# Altium schematic sheet 10_USB.SchDoc
size 420 x 297 mm; SheetNumber: 19; SheetTotal: 33
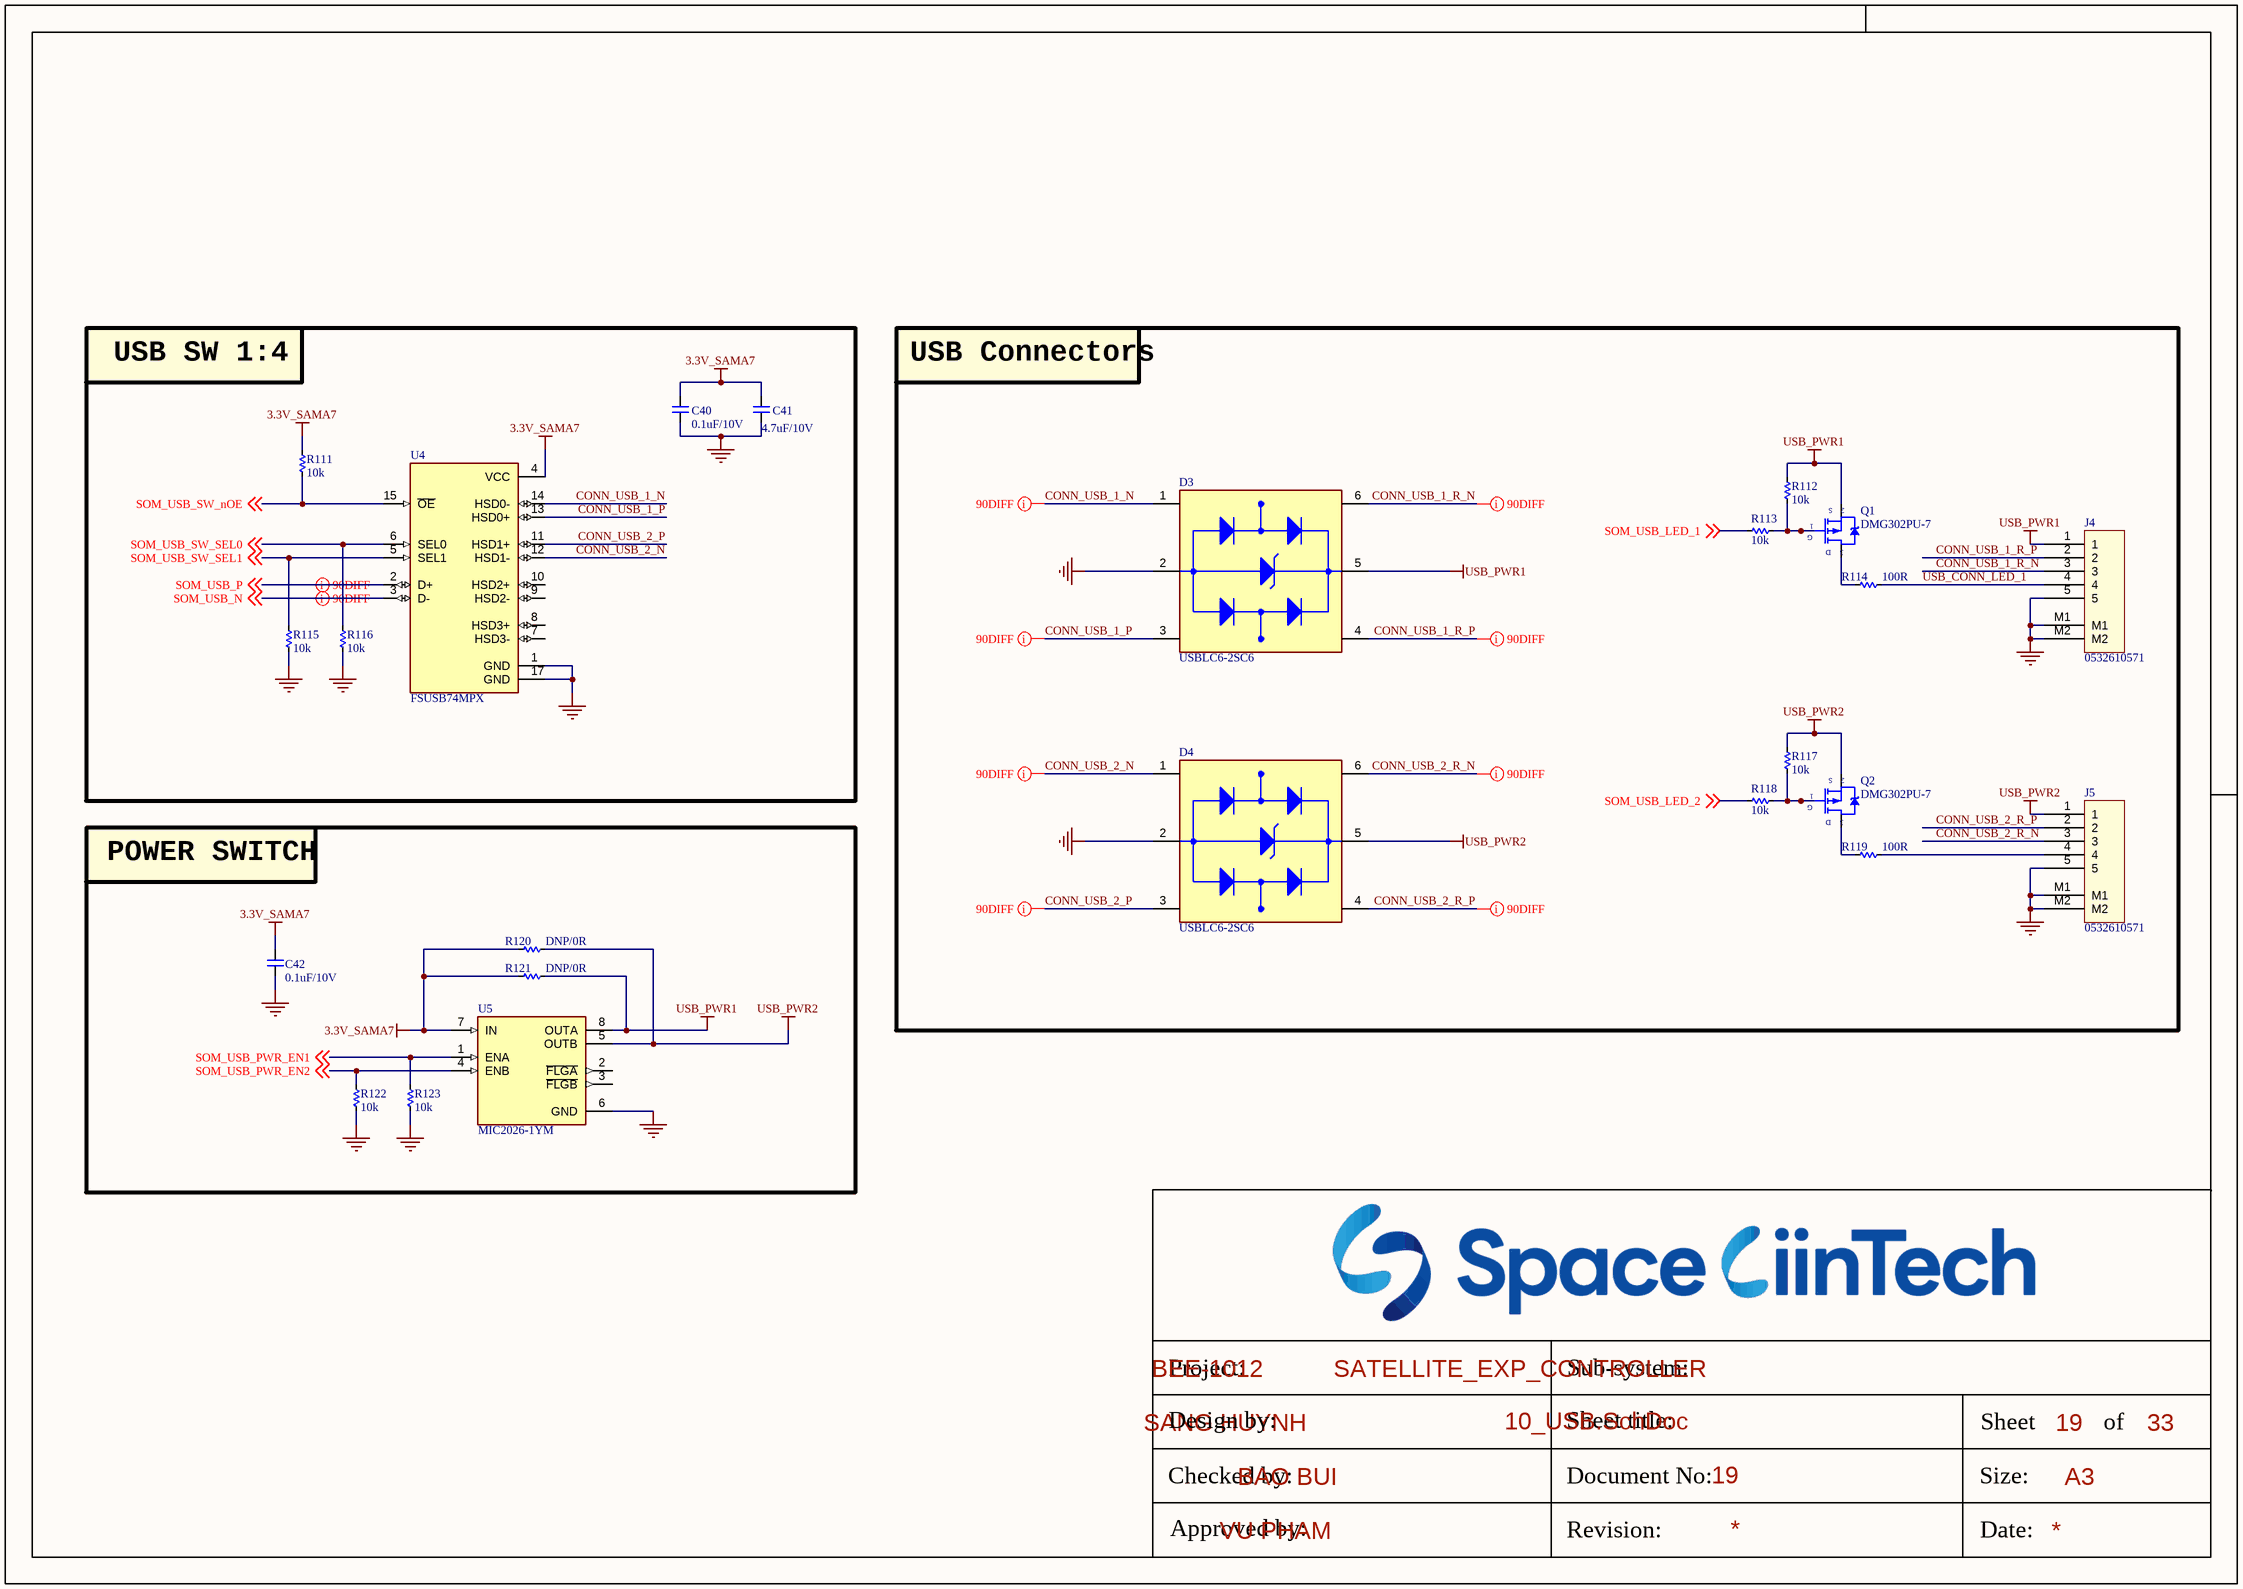
[diagram p0: 10_USB.SchDoc]

## Parts
C40  0.1uF/10V  [CAP_C_1005X50_L]
C41  4.7uF/10V  [CAP_C_1005X50_L]
C42  0.1uF/10V  [CAP_C_1005X50_L]
D3  USBLC6-2SC6  [SOT95P280X145-6N]
D4  USBLC6-2SC6  [SOT95P280X145-6N]
J4  0532610571  [MOLEX_0532610571]
J5  0532610571  [MOLEX_0532610571]
Q1  DMG302PU-7  [SOT95P240X120-3N]
Q2  DMG302PU-7  [SOT95P240X120-3N]
R111  10k  [RES_C_1005x30_L]
R112  10k  [RES_C_1005x30_L]
R113  10k  [RES_C_1005x30_L]
R114  100R  [RES_C_1005x30_L]
R115  10k  [RES_C_1005x30_L]
R116  10k  [RES_C_1005x30_L]
R117  10k  [RES_C_1005x30_L]
R118  10k  [RES_C_1005x30_L]
R119  100R  [RES_C_1005x30_L]
R120  DNP/0R  [RES_C_1005x30_L]
R121  DNP/0R  [RES_C_1005x30_L]
R122  10k  [RES_C_1005x30_L]
R123  10k  [RES_C_1005x30_L]
U4  FSUSB74MPX  [QFN50P300X300X80-17N]
U5  MIC2026-1YM  [SOIC127P602X173-8N]

## Blocks framed on the sheet
USB SW 1:4: C40 C41 R111 R115 R116 U4
USB Connectors: D3 D4 J4 J5 Q1 Q2 R112-R114 R117-R119
POWER SWITCH: C42 R120-R123 U5

## Nets
3.3V_SAMA7: C40.2 C41.2 C42.2 R111.1 R120.2 R121.2 U4.4(VCC) U5.7(IN)
GND: C40.1 C41.1 C42.1 D3.2(GND) D4.2(GND) J4.5 J4.M1 J4.M2 J5.5 J5.M1 J5.M2 R115.2 R116.2 R122.2 R123.2 U4.1(GND) U4.17(GND) U5.6(GND)
USB_PWR1: D3.5(VBUS) J4.1 Q1.2(S) R112.1 R121.1 U5.8(OUTA)
USB_PWR2: D4.5(VBUS) J5.1 Q2.2(S) R117.1 R120.1 U5.5(OUTB)
CONN_USB_1_N: D3.1(I/O1_IN) U4.14(HSD0-)
CONN_USB_1_P: D3.3(I/O2_IN) U4.13(HSD0+)
CONN_USB_1_R_N: D3.6(I/O1_OUT) J4.3
CONN_USB_1_R_P: D3.4(I/O2_OUT) J4.2
CONN_USB_2_N: D4.1(I/O1_IN) U4.12(HSD1-)
CONN_USB_2_P: D4.3(I/O2_IN) U4.11(HSD1+)
CONN_USB_2_R_N: D4.6(I/O1_OUT) J5.3
CONN_USB_2_R_P: D4.4(I/O2_OUT) J5.2
SOM_USB_LED_1: R113.1 ; off-sheet SOM_USB_LED_1
SOM_USB_LED_2: R118.1 ; off-sheet SOM_USB_LED_2
SOM_USB_N: U4.3(D-) ; off-sheet SOM_USB_N
SOM_USB_P: U4.2(D+) ; off-sheet SOM_USB_P
SOM_USB_PWR_EN1: R123.1 U5.1(ENA) ; off-sheet SOM_USB_PWR_EN1
SOM_USB_PWR_EN2: R122.1 U5.4(ENB) ; off-sheet SOM_USB_PWR_EN2
SOM_USB_SW_nOE: R111.2 U4.15(~{OE}) ; off-sheet SOM_USB_SW_nOE
SOM_USB_SW_SEL0: R116.1 U4.6(SEL0) ; off-sheet SOM_USB_SW_SEL0
SOM_USB_SW_SEL1: R115.1 U4.5(SEL1) ; off-sheet SOM_USB_SW_SEL1
USB_CONN_LED_1: J4.4 R114.2
NetJ5_4: J5.4 R119.2
NetQ1_1: Q1.1(G) R112.2 R113.2
NetQ1_3: Q1.3(D) R114.1
NetQ2_1: Q2.1(G) R117.2 R118.2
NetQ2_3: Q2.3(D) R119.1

Not connected (* = marked no-connect by the designer): U4 7(HSD3-) 8(HSD3+) 9(HSD2-) 10(HSD2+); U5 2(~{FLGA}) 3(~{FLGB})

## Layout directives
differential pair; differential pair class DIFF90: CONN_USB_1_N, CONN_USB_1_P, CONN_USB_1_R_N, CONN_USB_1_R_P, CONN_USB_2_N, CONN_USB_2_P, CONN_USB_2_R_N, CONN_USB_2_R_P, SOM_USB_N, SOM_USB_P

## Notes on the sheet
- Project:
- BEE-1012
- Sub-system:
- SATELLITE_EXP_CONTROLLER
- Design by:
- SANG HUYNH
- BAO BUI
- Sheet title:
- Sheet
- A3
- of
- Checked by:
- Approved by:
- VU PHAM
- Revision:
- Document No:
- Size:
- Date:

## Library data of the parts
C40-C42 = _CAP_C_2: CAP
D3 D4 = USBLC6-2SC6: 17V Clamp 5A (8/20Âµs) Ipp Tvs Diode Surface Mount SOT-23-6; MF: STMicroelectronics; Value: *; SnapEDA_Link: https://www.snapeda.com/parts/USBLC6-2SC6/STMicroelectronics/view-part/?ref=snap; Check_prices: https://www.snapeda.com/parts/USBLC6-2SC6/STMicroelectronics/view-part/?ref=eda; Purchase-URL: https://pricing.snapeda.com/search/part/USBLC6-2SC6/?ref=eda; Price: None; Availability: In Stock; Package: SOT-23-6 STMicroelectronics; MP: USBLC6-2SC6
J4 J5 = Header 5x1_2M
Q1 Q2 = MOSFET_P_GSD
R111-R123 = _RES_B_2: RES
U4 = IC_USB_SW_FSUSB74MPX: USB Switch IC 1 Channel 16-MLP (3x3); MF: ON Semiconductor; SnapEDA_Link: https://www.snapeda.com/parts/FSUSB74MPX/Onsemi/view-part/?ref=snap; Package: WQFN-16 ON Semiconductor; Value: *; MP: FSUSB74MPX; Check_prices: https://www.snapeda.com/parts/FSUSB74MPX/Onsemi/view-part/?ref=eda
U5 = IC_PWRSW_MIC2026-1YM: Power Switch/Driver 1:2 N-Channel 1.25A 8-SOIC; MF: Microchip; SnapEDA_Link: https://www.snapeda.com/parts/MIC2026-1YM/Microchip/view-part/?ref=snap; Package: SO-8 Microchip; Value: *; MP: MIC2026-1YM; Check_prices: https://www.snapeda.com/parts/MIC2026-1YM/Microchip/view-part/?ref=eda